# Altium project kl25_1.PrjPCB
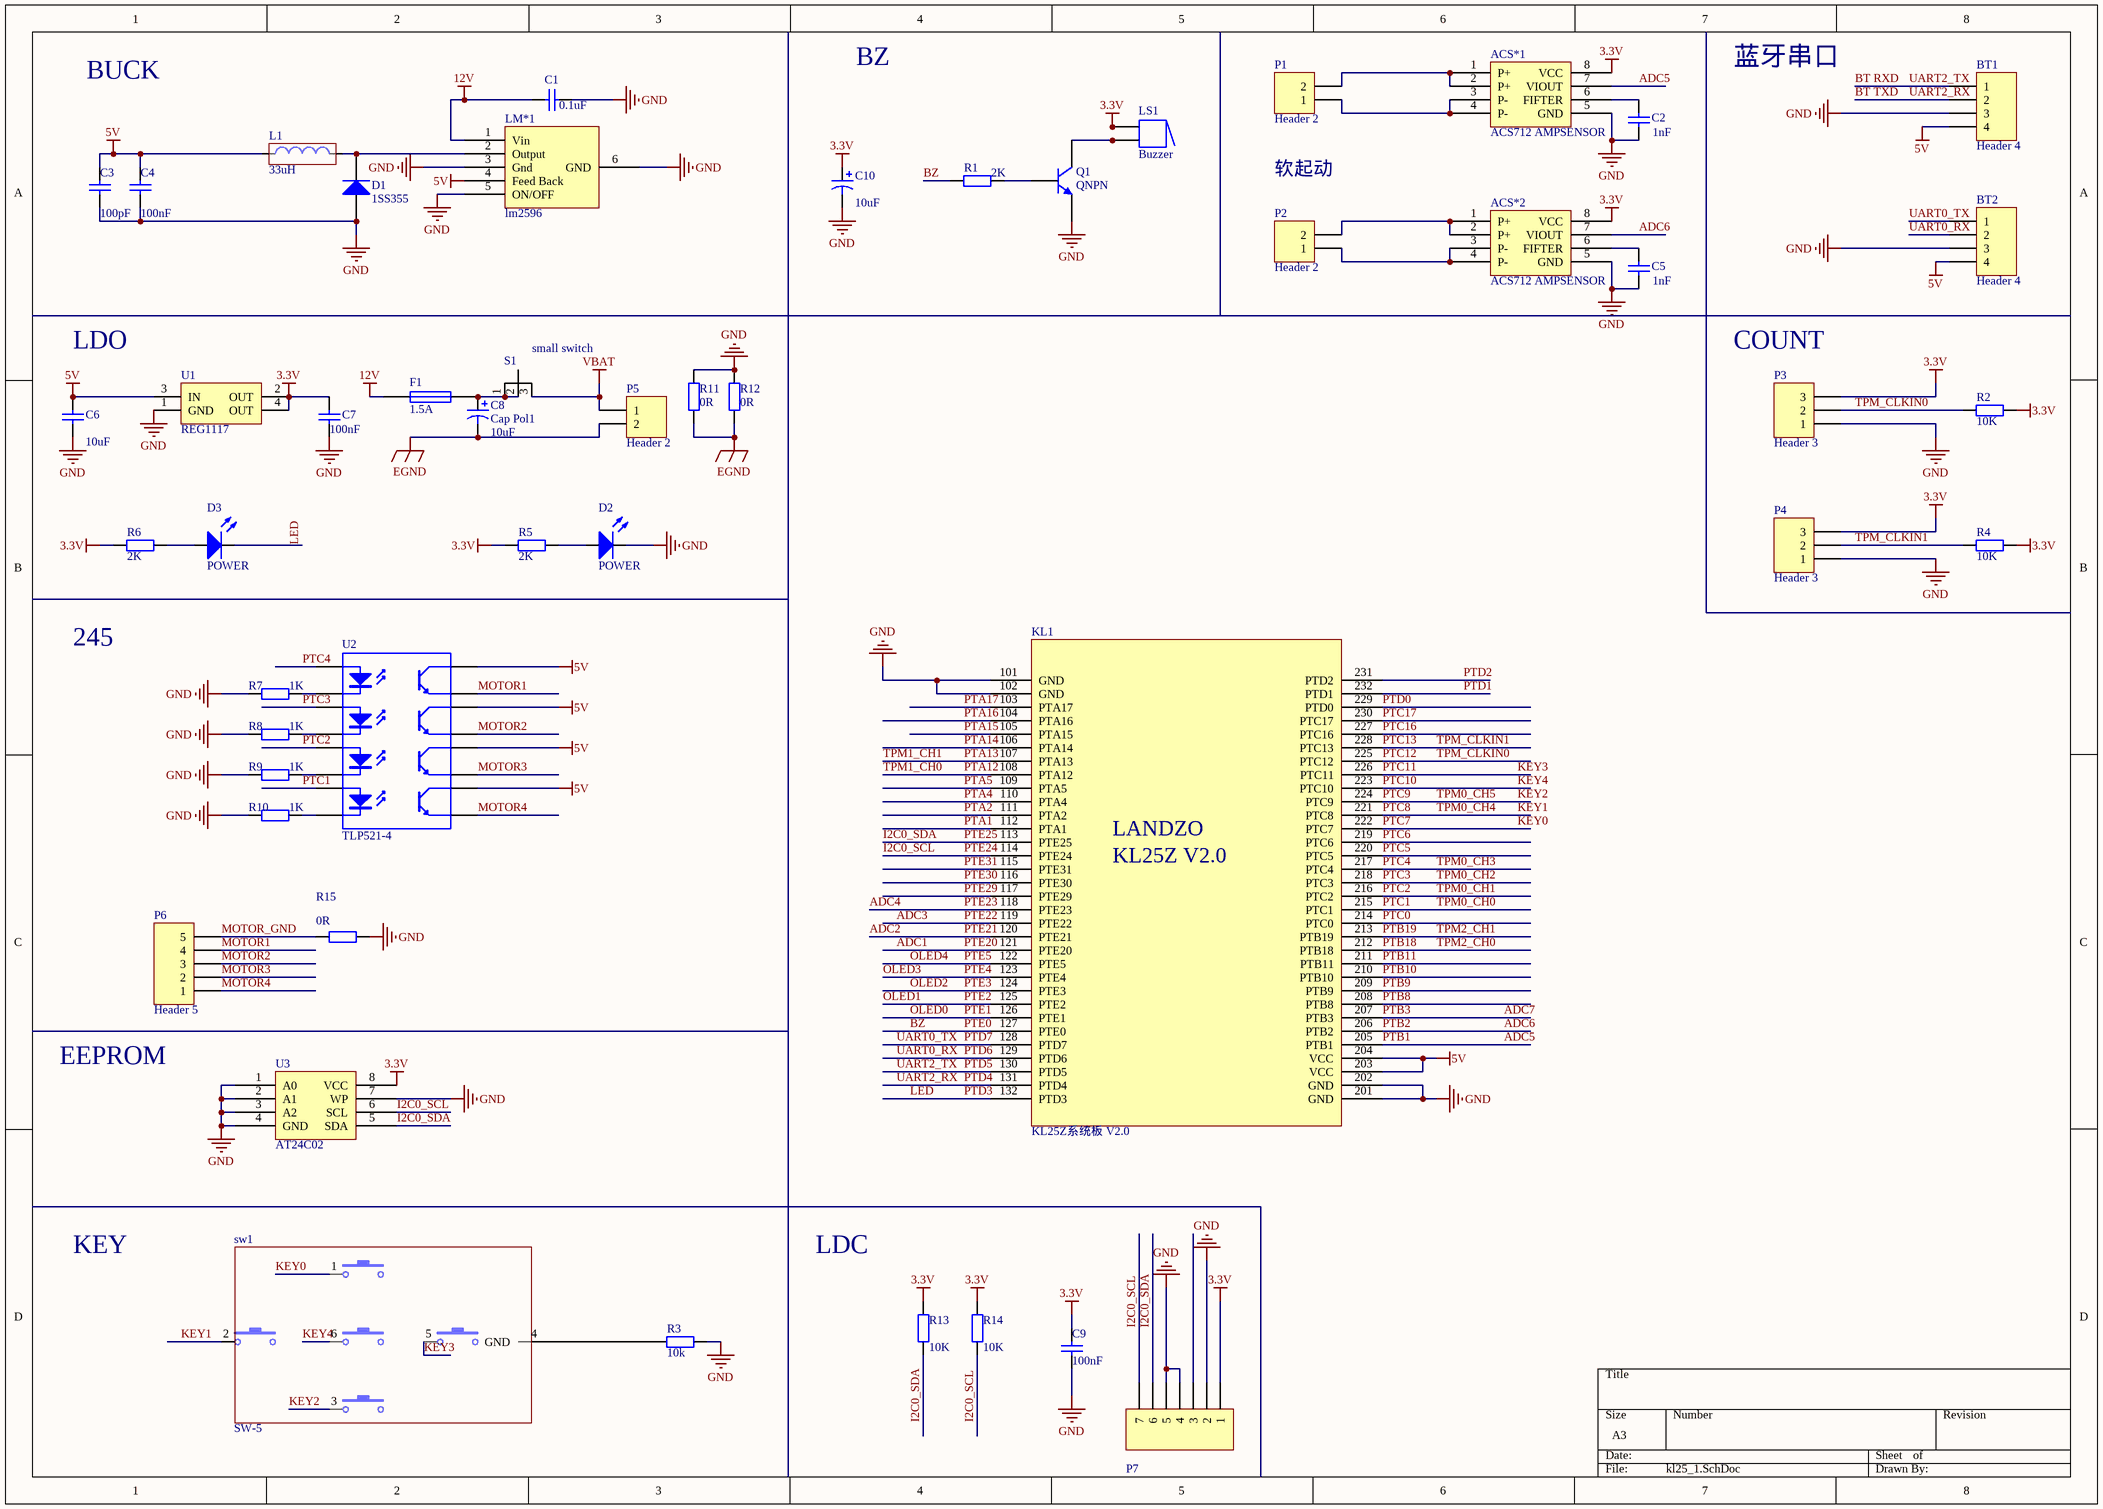
[diagram p0: kl25_1.SchDoc]
1 sheet, 50 parts. Net scope: global (net labels, ports and power ports of the same name join across sheets).
Board files: KL25_1.PcbDoc, KL25_2.PcbDoc

## Sheet kl25_1.SchDoc
size A3

### Parts
ACS*1  ACS712 AMPSENSOR  [SOIC1-8N ACS712]
ACS*2  ACS712 AMPSENSOR  [SOIC1-8N ACS712]
BT1  Header 4  [HDR1X4]
BT2  Header 4  [HDR1X4]
C1  value 0.1uF  [C2012]  (hidden comment: Cap)
C2  value 1nF  [C2012]  (hidden comment: Cap)
C3  value 100pF  [C2012]  (hidden comment: Cap)
C4  value 100nF  [C2012]  (hidden comment: Cap)
C5  value 1nF  [C2012]  (hidden comment: Cap)
C6  value 10uF  [C2012]  (hidden comment: Cap)
C7  value 100nF  [C2012]  (hidden comment: Cap)
C8  Cap Pol1  value 10uF  [SMD-EC-F8]
C9  100nF  [C2012]
C10  value 10uF  [1206(2)]  (hidden comment: Cap Pol1)
D1  1SS355  [SK54]
D2  POWER  [R2012]
D3  POWER  [R2012]
F1  1.5A  [1206(2)]
KL1  KL25Z系统板 V2.0  [KL25 V2.0系统板]
L1  33uH  [SMD-EC-F8]
LM*1  lm2596  [lm2596]
LS1  Buzzer  [ABSM-1574]
P1  Header 2  [HDR1X2]
P2  Header 2  [HDR1X2]
P3  Header 3  [HDR1X3]
P4  Header 3  [HDR1X3]
P5  Header 2  [HDR1X2]
P6  Header 5  [HDR1X5]
P7  Header 7  [HDR1X7]  (value not drawn)
Q1  QNPN  [SOT23_N]
R1  value 2K  [R2012]  (hidden comment: Res2)
R2  value 10K  [R2012]  (hidden comment: Res2)
R3  10k  [R2012]
R4  value 10K  [R2012]  (hidden comment: Res2)
R5  2K  [R2012]
R6  2K  [R2012]
R7  value 1K  [R2012]  (hidden comment: Res2)
R8  value 1K  [R2012]  (hidden comment: Res2)
R9  value 1K  [R2012]  (hidden comment: Res2)
R10  value 1K  [R2012]  (hidden comment: Res2)
R11  value 0R  [1206(2)]  (hidden comment: Res2)
R12  value 0R  [1206(2)]  (hidden comment: Res2)
R13  value 10K  [R2012]  (hidden comment: Res2)
R14  value 10K  [R2012]  (hidden comment: Res2)
R15  value 0R  [1206(2)]  (hidden comment: Res2)
S1  small switch  [small switch]
sw1  SW-5  [SW-5]
U1  REG1117  [SOT223]
U2  TLP521-4  [DIP-16]
U3  AT24C02  [IR2104]

### Nets
3.3V: ACS*1.8(VCC) ACS*2.8(VCC) C7.2 C9.2 C10.1 LS1.1 LS1.1A P3.3 P4.3 P7.1 R2.1 R4.1 R5.2 R6.2 R13.2 R14.2 U1.2(OUT) U1.4(OUT) U3.8(VCC)
5V: BT1.4 BT2.4 C3.2 C4.2 C6.2 KL1.203(VCC) KL1.204(VCC) L1.1 LM*1.4(Feed_Back) U1.3(IN) U2.10 U2.12 U2.14 U2.16
12V: C1.2 F1.1 LM*1.1(Vin)
EGND: C8.2 P5.2 R11.2 R12.2
GND: ACS*1.5(GND) ACS*2.5(GND) BT1.3 BT2.3 C1.1 C2.1 C3.1 C4.1 C5.1 C6.1 C7.1 C9.1 C10.2 D1.1(A) D2.2 KL1.101(GND) KL1.102(GND) KL1.201(GND) KL1.202(GND) LM*1.3(Gnd) LM*1.5(ON/OFF) LM*1.6(GND) P3.1 P4.1 P7.2 P7.4 P7.5 Q1.3(E) R3.1 R7.2 R8.2 R9.2 R10.2 R11.1 R12.1 R15.1 U1.1(GND) U3.1(A0) U3.2(A1) U3.3(A2) U3.4(GND) U3.7(WP)
VBAT: P5.1 S1.3
ADC1: KL1.121(PTE20)  [also labelled PTE20]
ADC2: KL1.120(PTE21)  [also labelled PTE21]
ADC3: KL1.119(PTE22)  [also labelled PTE22]
ADC4: KL1.118(PTE23)  [also labelled PTE23]
ADC5: ACS*1.7(VIOUT) KL1.205(PTB1)  [also labelled PTB1]
ADC6: ACS*2.7(VIOUT) KL1.206(PTB2)  [also labelled PTB2]
ADC7: KL1.207(PTB3)  [also labelled PTB3]
BT RXD: BT1.1 KL1.130(PTD5)  [also labelled PTD5, UART2_TX]
BT TXD: BT1.2 KL1.131(PTD4)  [also labelled PTD4, UART2_RX]
BZ: KL1.127(PTE0) R1.2  [also labelled PTE0]
I2C0_SCL: KL1.114(PTE24) P7.7 R14.1 U3.6(SCL)  [also labelled PTE24]
I2C0_SDA: KL1.113(PTE25) P7.6 R13.1 U3.5(SDA)  [also labelled PTE25]
KEY0: KL1.222(PTC7) sw1.1  [also labelled PTC7]
KEY1: KL1.221(PTC8) sw1.2  [also labelled PTC8, TPM0_CH4]
KEY2: KL1.224(PTC9) sw1.3  [also labelled PTC9, TPM0_CH5]
KEY3: KL1.226(PTC11) sw1.5  [also labelled PTC11]
KEY4: KL1.223(PTC10) sw1.6  [also labelled PTC10]
LED: D3.2 KL1.132(PTD3)  [also labelled PTD3]
MOTOR1: P6.4 U2.15
MOTOR2: P6.3 U2.13
MOTOR3: P6.2 U2.11
MOTOR4: P6.1 U2.9
MOTOR_GND: P6.5 R15.2
OLED0: KL1.126(PTE1)  [also labelled PTE1]
OLED1: KL1.125(PTE2)  [also labelled PTE2]
OLED2: KL1.124(PTE3)  [also labelled PTE3]
OLED3: KL1.123(PTE4)  [also labelled PTE4]
OLED4: KL1.122(PTE5)  [also labelled PTE5]
PTA1: KL1.112(PTA1)
PTA2: KL1.111(PTA2)
PTA4: KL1.110(PTA4)
PTA5: KL1.109(PTA5)
PTA12: KL1.108(PTA12)  [also labelled TPM1_CH0]
PTA13: KL1.107(PTA13)  [also labelled TPM1_CH1]
PTA14: KL1.106(PTA14)
PTA15: KL1.105(PTA15)
PTA16: KL1.104(PTA16)
PTA17: KL1.103(PTA17)
PTB8: KL1.208(PTB8)
PTB9: KL1.209(PTB9)
PTB10: KL1.210(PTB10)
PTB11: KL1.211(PTB11)
PTB18: KL1.212(PTB18)  [also labelled TPM2_CH0]
PTB19: KL1.213(PTB19)  [also labelled TPM2_CH1]
PTC0: KL1.214(PTC0)
PTC1: KL1.215(PTC1) U2.7  [also labelled TPM0_CH0]
PTC2: KL1.216(PTC2) U2.5  [also labelled TPM0_CH1]
PTC3: KL1.218(PTC3) U2.3  [also labelled TPM0_CH2]
PTC4: KL1.217(PTC4) U2.1  [also labelled TPM0_CH3]
PTC5: KL1.220(PTC5)
PTC6: KL1.219(PTC6)
PTC12: KL1.225(PTC12) P3.2 R2.2  [also labelled TPM_CLKIN0]
PTC13: KL1.228(PTC13) P4.2 R4.2  [also labelled TPM_CLKIN1]
PTC16: KL1.227(PTC16)
PTC17: KL1.230(PTC17)
PTD0: KL1.229(PTD0)
PTD1: KL1.232(PTD1)
PTD2: KL1.231(PTD2)
PTD6: BT2.2 KL1.129(PTD6)  [also labelled UART0_RX]
PTD7: BT2.1 KL1.128(PTD7)  [also labelled UART0_TX]
PTE29: KL1.117(PTE29)
PTE30: KL1.116(PTE30)
PTE31: KL1.115(PTE31)
NetACS*1_1: ACS*1.1(P+) ACS*1.2(P+) P1.2
NetACS*1_3: ACS*1.3(P-) ACS*1.4(P-) P1.1
NetACS*1_6: ACS*1.6(FIFTER) C2.2
NetACS*2_1: ACS*2.1(P+) ACS*2.2(P+) P2.2
NetACS*2_3: ACS*2.3(P-) ACS*2.4(P-) P2.1
NetACS*2_6: ACS*2.6(FIFTER) C5.2
NetC8_1: C8.1 F1.2 S1.1 S1.2
NetD1_2: D1.2(K) L1.2 LM*1.2(Output)
NetD2_1: D2.1 R5.1
NetD3_1: D3.1 R6.1
NetLS1_2: LS1.2 LS1.2A Q1.1(C)
NetQ1_2: Q1.2(B) R1.1
NetR3_2: R3.2 sw1.4(GND)
NetR7_1: R7.1 U2.2
NetR8_1: R8.1 U2.4
NetR9_1: R9.1 U2.6
NetR10_1: R10.1 U2.8

Not connected (* = marked no-connect by the designer): P7 3

### Notes on the sheet
- BUCK
- BZ
- 蓝牙串口
- 软起动
- LDO
- (near P3) COUNT
- 245
- EEPROM
- KEY
- LDC
- (in symbol KL25Z系统板 V2.0) LANDZO; KL25Z V2.0

### Library data of the parts
BT1 BT2 = Header 4: Header, 4-Pin; LatestRevisionDate: 17-Jul-2002; LatestRevisionNote: Re-released for DXP Platform.; Publisher: Altium Limited
C1 C3 C4 C9 = Cap: Capacitor
  C1 C3 C4: Published: 8-Jun-2000; LatestRevisionDate: 17-Jul-2002; LatestRevisionNote: Re-released for DXP Platform.; PackageReference: RAD-0.3; Publisher: Altium Limited; PackageDescription: Radial Cap, Thru-Hole; 2 Leads; 0.3 in Pin Spacing
C2 C5-C7 = Cap: 贴片电容; Published: 8-Jun-2000; LatestRevisionDate: 17-Jul-2002; LatestRevisionNote: Re-released for DXP Platform.; PackageReference: RAD-0.3; Publisher: Altium Limited
C8 C10 = Cap Pol1: Polarized Capacitor (Radial); Published: 8-Jun-2000; LatestRevisionDate: 17-Jul-2002; LatestRevisionNote: Re-released for DXP Platform.; PackageReference: RB7.6-15; Publisher: Altium Limited; PackageDescription: Polarized Capacitor (Radial); 2 Leads
D1 = Diode 1N4148: High Conductance Fast Diode; LatestRevisionDate: 17-Jul-2002; LatestRevisionNote: Re-released for DXP Platform.; DatasheetDocument: 1997; PackageReference: DO-35; Publisher: Altium Limited; Code_JEDEC: DO-204-AH; ComponentLink1Description: Manufacturer Link; ComponentLink2Description: Datasheet; ComponentLink2URL: http://www.fairchildsemi.com/ds/1N%2F1N4148.pdf
D2 D3 = LED: Typical INFRARED GaAs LED
F1 = Fuse 1: Fuse; Published: 8-Jun-2000; LatestRevisionDate: 17-Jul-2002; LatestRevisionNote: Re-released for DXP Platform.; PackageReference: PIN-W2/E2.8; Publisher: Altium Limited
L1 = Inductor
LS1 = Buzzer: Magnetic Transducer Buzzer; pin to pad: 1>1A 2>2A; Published: 24-Mar-1999; LatestRevisionDate: 17-Dec-2003; LatestRevisionNote: Schematic revised, PCB Footprint replaced.; DatasheetVersion: 17-Dec-2003; PackageReference: ABSM-1574; Publisher: Altium Limited; ComponentLink1Description: Manufacturer Link; ComponentLink1URL: http://www.megastar.com/linecard/buzzmode/index.php
P1 P2 P5 = Header 2: Header, 2-Pin; LatestRevisionDate: 17-Jul-2002; LatestRevisionNote: Re-released for DXP Platform.; Publisher: Altium Limited
P3 P4 = Header 3: Header, 3-Pin; LatestRevisionDate: 17-Jul-2002; LatestRevisionNote: Re-released for DXP Platform.; Publisher: Altium Limited
P6 = Header 5: Header, 5-Pin; LatestRevisionDate: 17-Jul-2002; LatestRevisionNote: Re-released for DXP Platform.; Publisher: Altium Limited
P7 = Header 7: Header, 7-Pin; LatestRevisionDate: 17-Jul-2002; LatestRevisionNote: Re-released for DXP Platform.; Publisher: Altium Limited
Q1 = QNPN: NPN Bipolar Transistor; pin to pad: 2>3 3>2; Published: 8-Jun-2000; LatestRevisionDate: 29-May-2009; LatestRevisionNote: IPC-7351 Footprint Added.; PackageVersion: Aug-1999; PackageReference: SOT-23B; Publisher: Altium Limited; PackageDescription: 3-Pin SOT-23 Package 0.95 mm Pitch, 2.4 mm Lead Span
R1 R2 R4 R7-R15 = Res2: Resistor; Published: 8-Jun-2000; LatestRevisionDate: 17-Jul-2002; LatestRevisionNote: Re-released for DXP Platform.; PackageReference: AXIAL-0.4; Publisher: Altium Limited; PackageDescription: Axial Device, Thru-Hole; 2 Leads; 0.4 in Pin Spacing
R3 = Res: Resistor of led
R5 R6 = Res: Resistor
U1 = REG1117: 800mA and 1A Low Dropout Positive Regulator 2.85V, 3.3V, 5V, and Adjustable; Published: 8-Jun-2000; LatestRevisionDate: 17-Jul-2002; LatestRevisionNote: Re-released for DXP Platform.; DatasheetVersion: Sep-1997; PackageVersion: revC; PackageReference: ZZ311; Publisher: Altium Limited; PackageDescription: SOT-223/SC-73; 4 Leads; Body 6.7 x 7.3 mm, inc. leads (LxW max); ComponentLink1Description: Manufacturer Link; ComponentLink1URL: http://www.ti.com/; ComponentLink2Description: Datasheet; ComponentLink2URL: http://www-s.ti.com/sc/ds/REG1117.pdf